# EAGLE schematic upperArm (EAGLE 9.6.2)
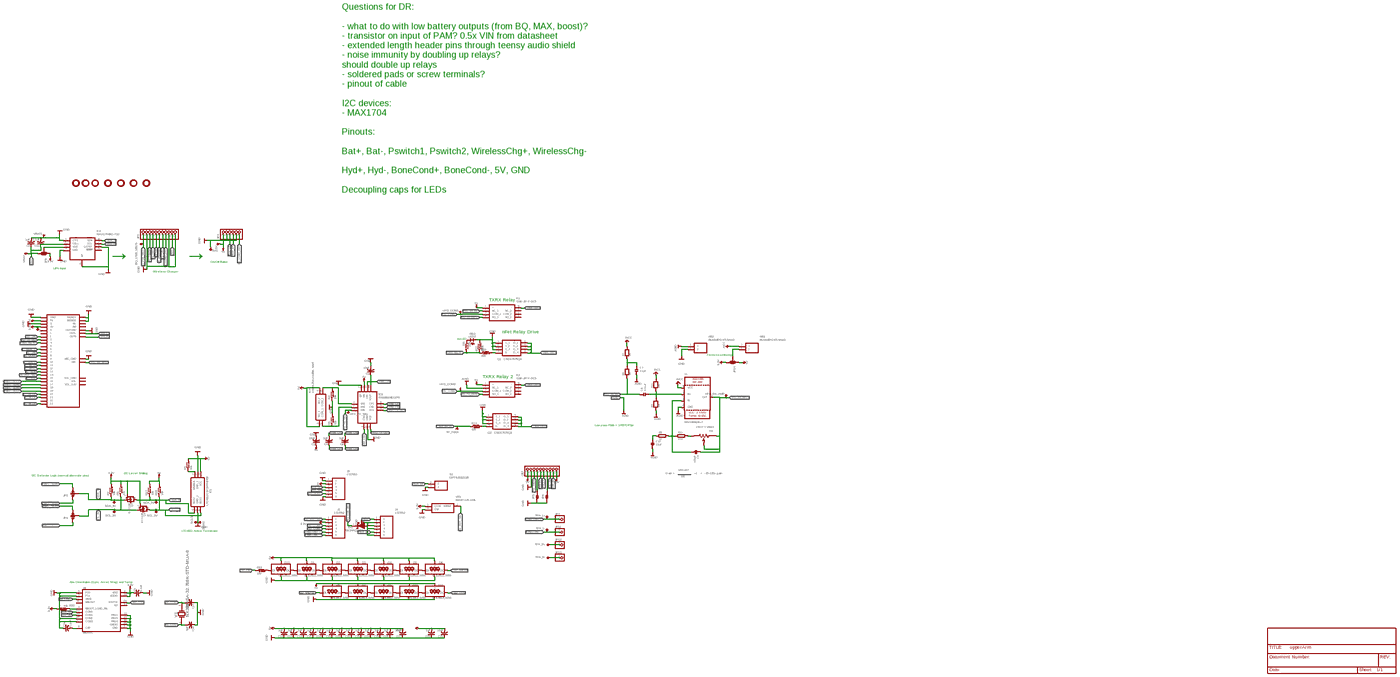
[diagram p0: schematic, sheet 1, overview]
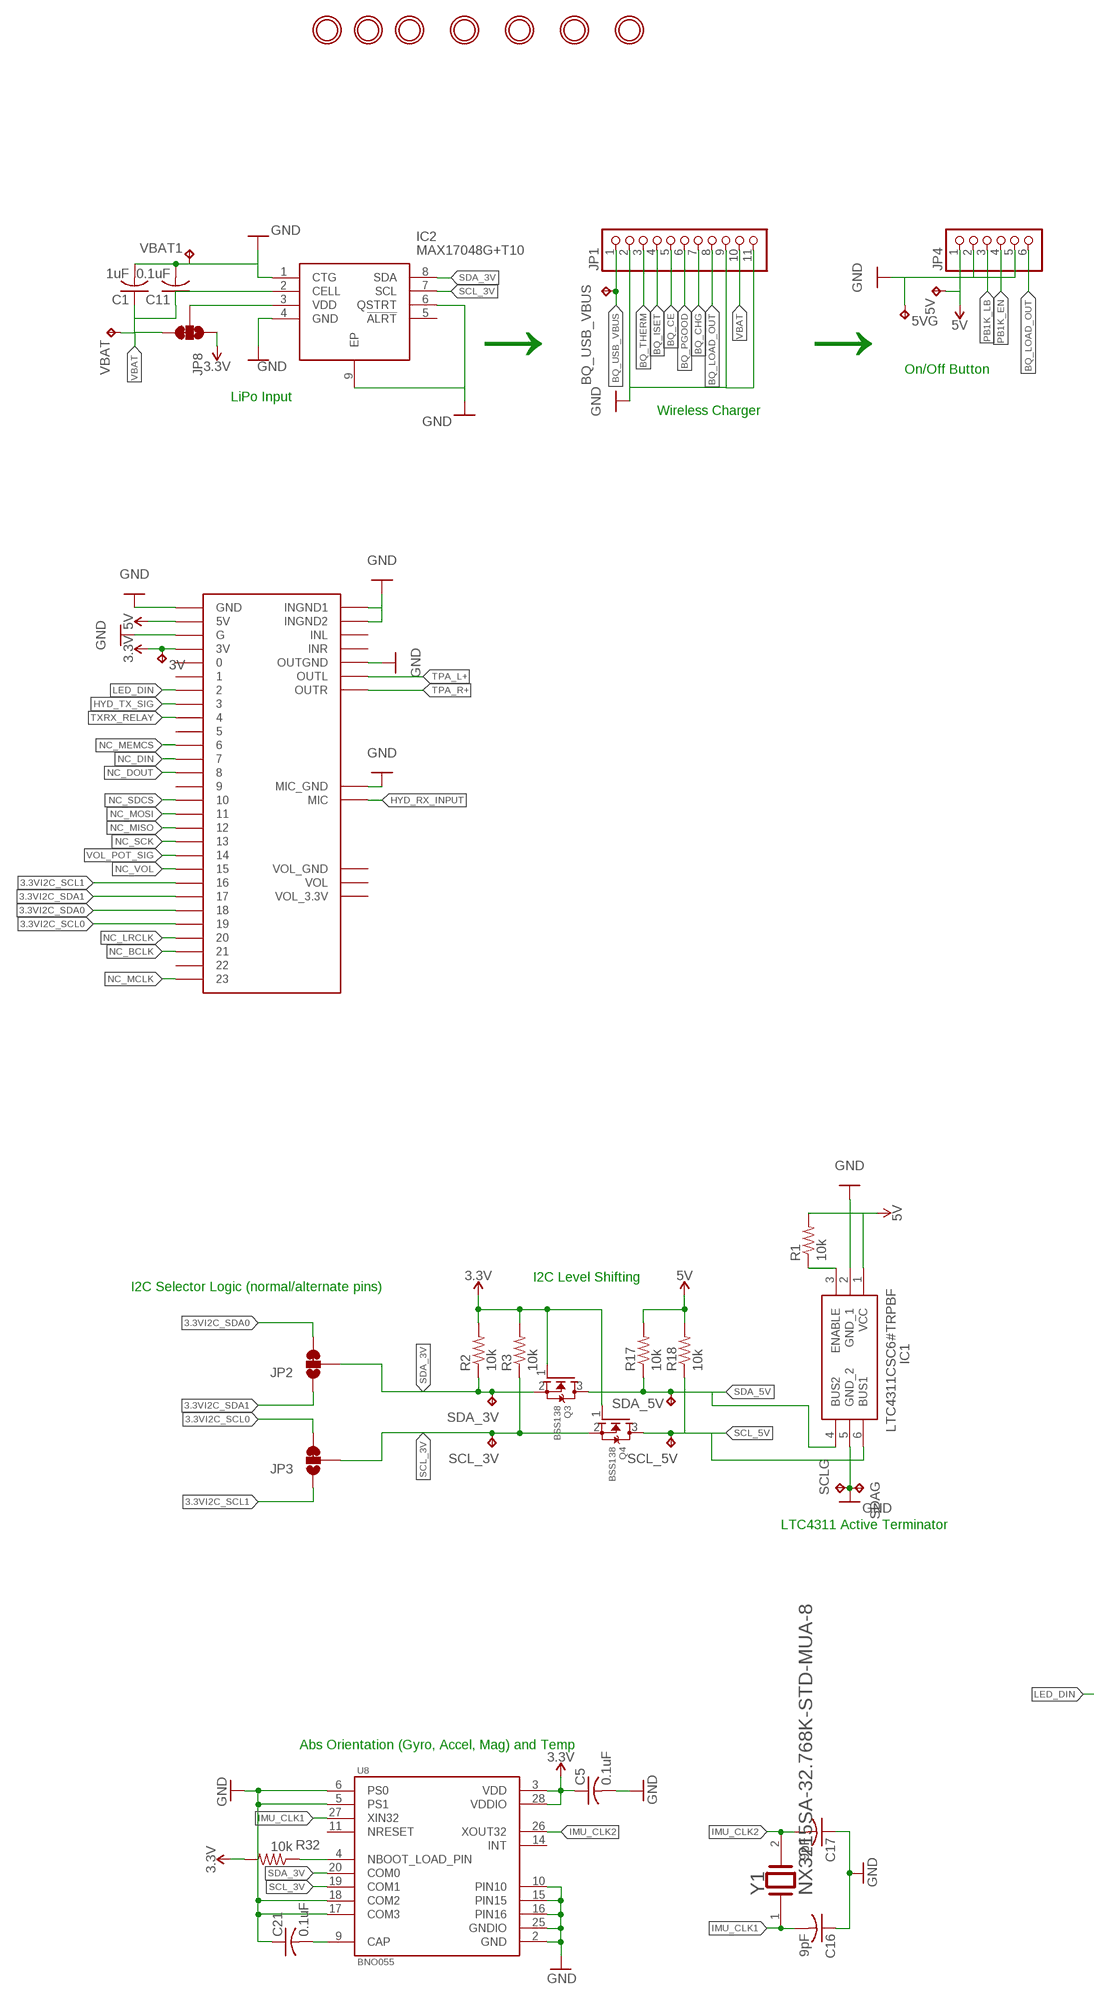
[diagram p1: schematic, sheet 1, part 1 of 4]
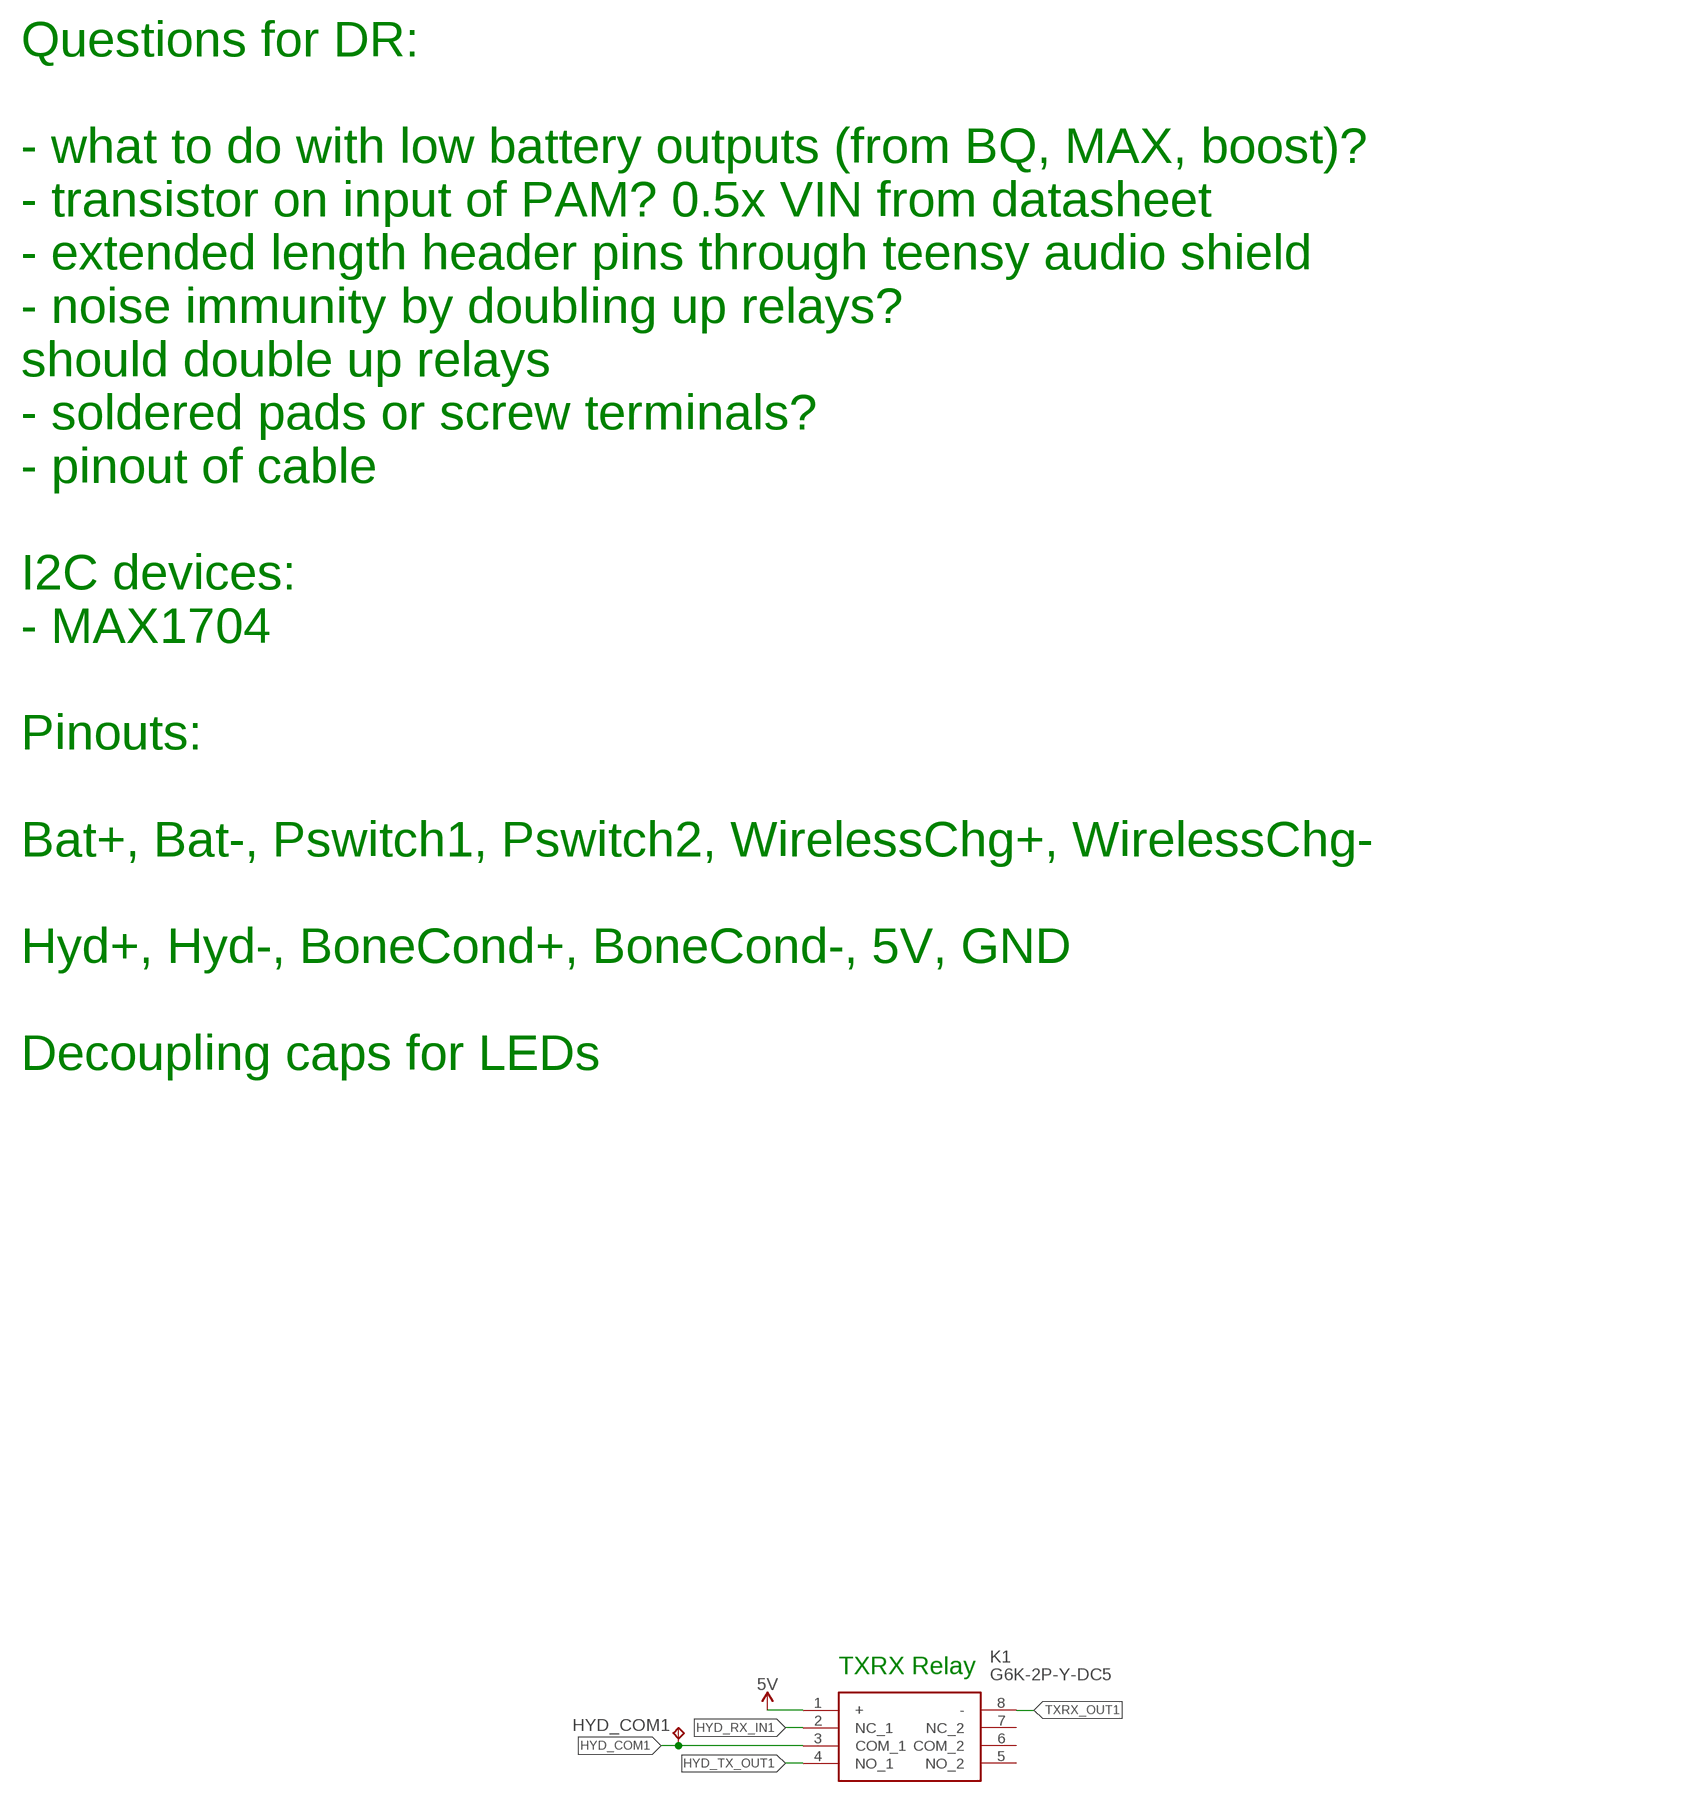
[diagram p2: schematic, sheet 1, part 2 of 4]
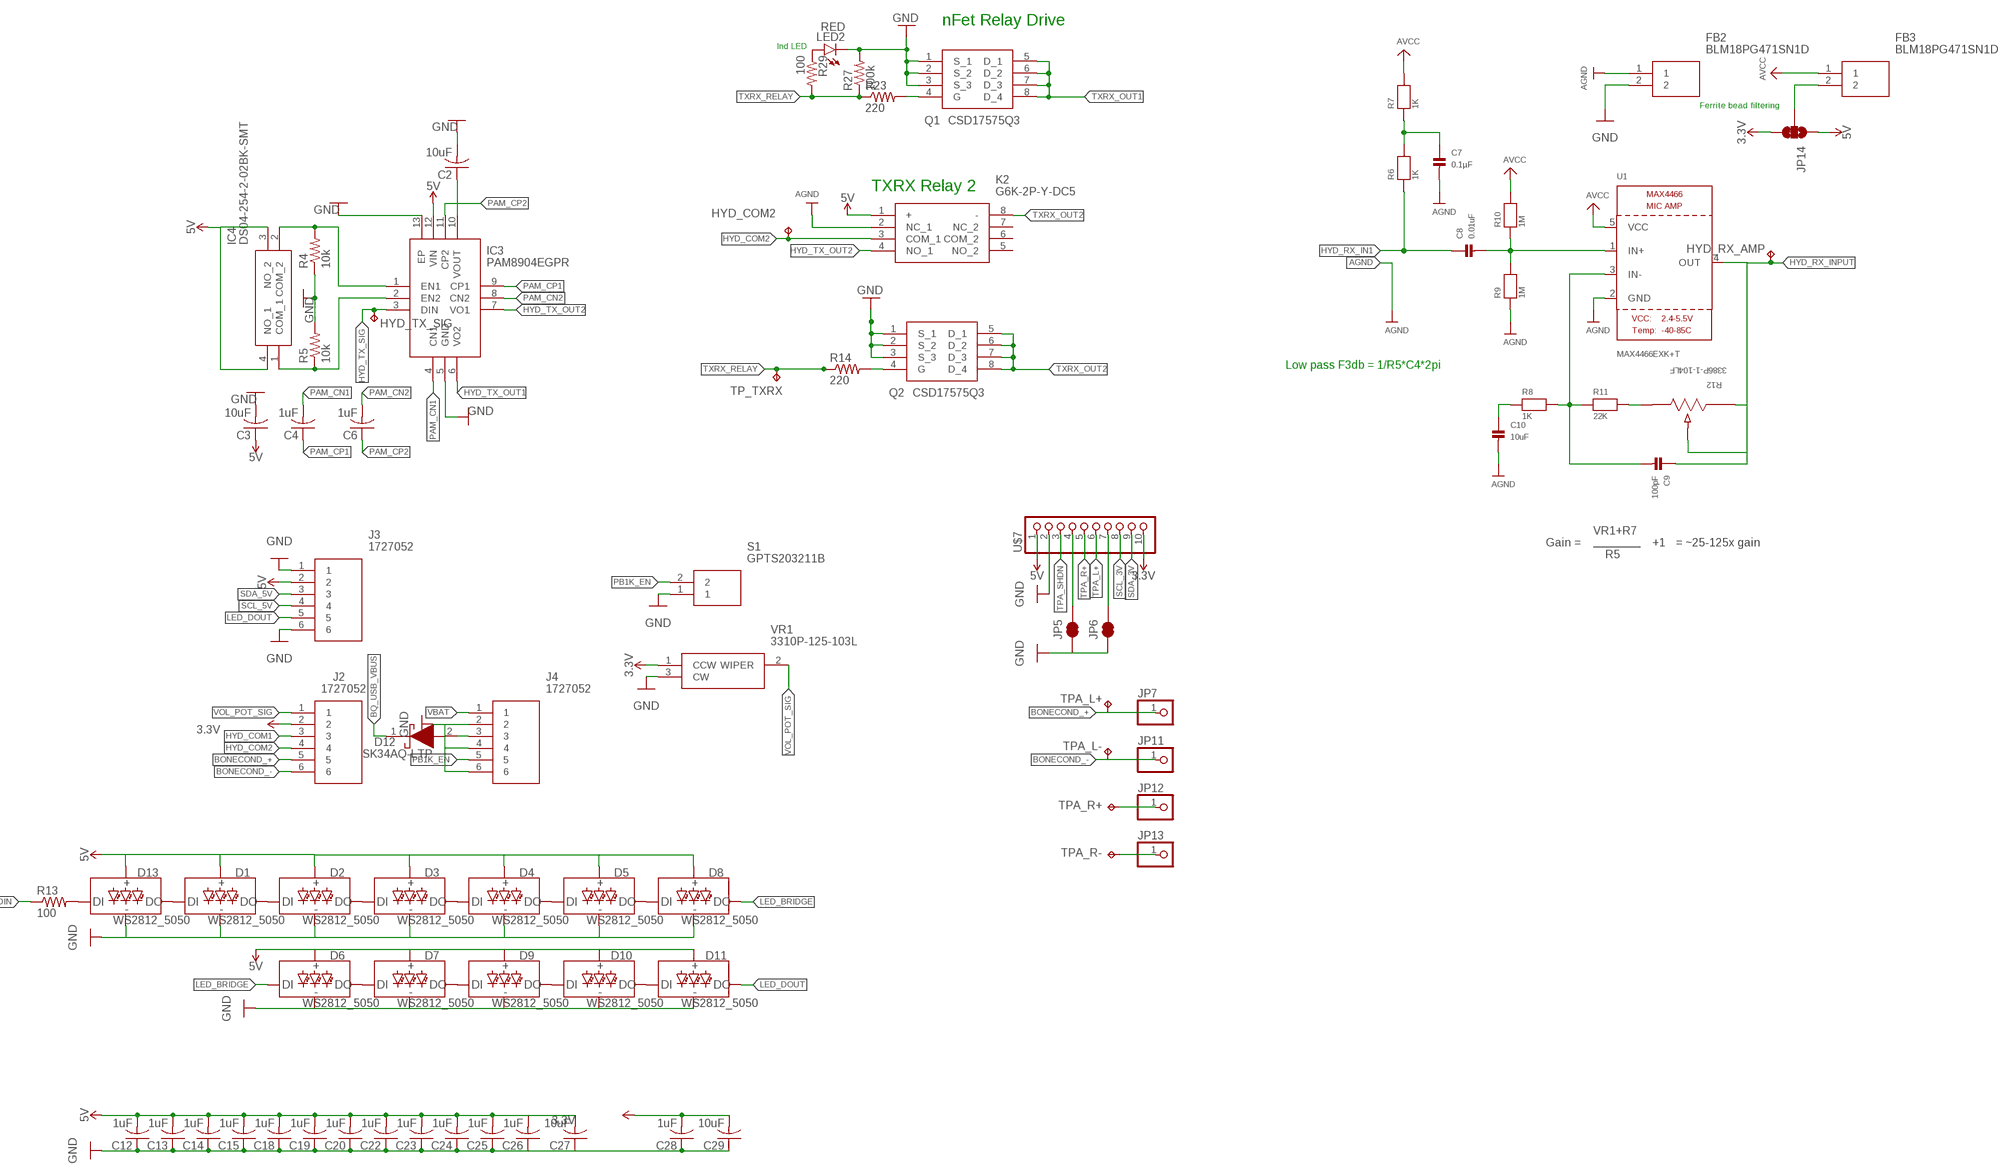
[diagram p3: schematic, sheet 1, part 3 of 4]
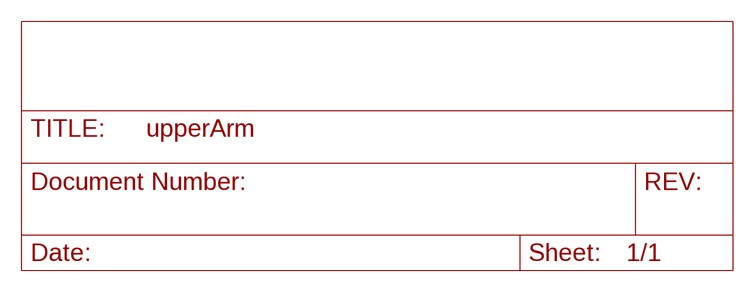
[diagram p4: schematic, sheet 1, part 4 of 4]

## Parts
3V  TPB1,27  [B1,27]
5V  TPB1,27  [B1,27]
5VG  TPB1,27  [B1,27]
BQ_USB_VBUS  TPB1,27  [B1,27]
C1  1uF  C-USC0805  [C0805]
C2  10uF  C-USC0805  [C0805]
C3  10uF  C-USC0805  [C0805]
C4  1uF  C-USC0805  [C0805]
C5  0.1uF  C-USC0805  [C0805]
C6  1uF  C-USC0805  [C0805]
C7  0.1µF  CAP_CERAMIC0805  [0805]
C8  0.01uF  CAP_CERAMIC0805  [0805]
C9  100pF  CAP_CERAMIC0805  [0805]
C10  10uF  CAP_CERAMIC0805  [0805]
C11  0.1uF  C-USC0805  [C0805]
C12  1uF  C-USC0805  [C0805]
C13  1uF  C-USC0805  [C0805]
C14  1uF  C-USC0805  [C0805]
C15  1uF  C-USC0805  [C0805]
C16  9pF  C-USC0805  [C0805]
C17  9pF  C-USC0805  [C0805]
C18  1uF  C-USC0805  [C0805]
C19  1uF  C-USC0805  [C0805]
C20  1uF  C-USC0805  [C0805]
C21  0.1uF  C-USC0805  [C0805]
C22  1uF  C-USC0805  [C0805]
C23  1uF  C-USC0805  [C0805]
C24  1uF  C-USC0805  [C0805]
C25  1uF  C-USC0805  [C0805]
C26  1uF  C-USC0805  [C0805]
C27  10uF  C-USC0805  [C0805]
C28  1uF  C-USC0805  [C0805]
C29  10uF  C-USC0805  [C0805]
D1  WS2812_5050  [WS2812-5X5-4PIN]
D2  WS2812_5050  [WS2812-5X5-4PIN]
D3  WS2812_5050  [WS2812-5X5-4PIN]
D4  WS2812_5050  [WS2812-5X5-4PIN]
D5  WS2812_5050  [WS2812-5X5-4PIN]
D6  WS2812_5050  [WS2812-5X5-4PIN]
D7  WS2812_5050  [WS2812-5X5-4PIN]
D8  WS2812_5050  [WS2812-5X5-4PIN]
D9  WS2812_5050  [WS2812-5X5-4PIN]
D10  WS2812_5050  [WS2812-5X5-4PIN]
D11  WS2812_5050  [WS2812-5X5-4PIN]
D12  SK34AQ-LTP  [DIOM5226X244N]
D13  WS2812_5050  [WS2812-5X5-4PIN]
FB2  BLM18PG471SN1D  [BLM18SP221SN1B]
FB3  BLM18PG471SN1D  [BLM18SP221SN1B]
HYD_COM1  TPB1,27  [B1,27]
HYD_COM2  TPB1,27  [B1,27]
HYD_RX_AMP  TPB1,27  [B1,27]
HYD_TX_SIG  TPB1,27  [B1,27]
IC1  LTC4311CSC6#TRPBF  [SOT65P210X100-6N]
IC2  MAX17048G+T10  [SON50P200X200X80-9N]
IC3  PAM8904EGPR  [QFN40P200X200X80-13N]
IC4  DS04-254-2-02BK-SMT  [DS04254202BKSMT]
J2  1727052  [1727052]
J3  1727052  [1727052]
J4  1727052  [1727052]
JP1  PINHD-1X11  [1X11]
JP2  JUMPER-SMT_3_1-NC_TRACE_NO-SILK  [SMT-JUMPER_3_1-NC_TRACE_NO-SILK]
JP3  JUMPER-SMT_3_1-NC_TRACE_NO-SILK  [SMT-JUMPER_3_1-NC_TRACE_NO-SILK]
JP4  PINHD-1X6  [1X06]
JP5  JUMPER-SMT_2_NC_TRACE_NO-SILK  [SMT-JUMPER_2_NC_TRACE_NO-SILK]
JP6  JUMPER-SMT_2_NC_TRACE_NO-SILK  [SMT-JUMPER_2_NC_TRACE_NO-SILK]
JP7  PINHD-1X1  [1X01]
JP8  JUMPER-SMT_3_1-NC_TRACE_NO-SILK  [SMT-JUMPER_3_1-NC_TRACE_NO-SILK]
JP11  PINHD-1X1  [1X01]
JP12  PINHD-1X1  [1X01]
JP13  PINHD-1X1  [1X01]
JP14  JUMPER-SMT_3_1-NC_TRACE_NO-SILK  [SMT-JUMPER_3_1-NC_TRACE_NO-SILK]
K1  G6K-2P-Y-DC5  [G6K2PYDC12]
K2  G6K-2P-Y-DC5  [G6K2PYDC12]
LED2  RED  LEDCHIP-LED0805  [CHIP-LED0805]
Q1  CSD17575Q3  [CSD16327]
Q2  CSD17575Q3  [CSD16327]
Q3  BSS138  MOSFET-NWIDE  [SOT23-WIDE]
Q4  BSS138  MOSFET-NWIDE  [SOT23-WIDE]
R1  10k  R-US_R0805  [R0805]
R2  10k  R-US_R0805  [R0805]
R3  10k  R-US_R0805  [R0805]
R4  10k  R-US_R0805  [R0805]
R5  10k  R-US_R0805  [R0805]
R6  1K  RESISTOR0805  [0805]
R7  1K  RESISTOR0805  [0805]
R8  1K  RESISTOR0805  [0805]
R9  1M  RESISTOR0805  [0805]
R10  1M  RESISTOR0805  [0805]
R11  22K  RESISTOR0805  [0805]
R12  3386P-1-104LF  [POT_3386P]
R13  100  R-US_R0603  [R0603]
R14  220  R-US_R0805  [R0805]
R17  10k  R-US_R0805  [R0805]
R18  10k  R-US_R0805  [R0805]
R23  220  R-US_R0805  [R0805]
R27  100k  R-US_R0805  [R0805]
R29  100  R-US_R0805  [R0805]
R32  10k  R-US_R0805  [R0805]
S1  GPTS203211B  [GPTS203211B]
SCL_3V  TPB1,27  [B1,27]
SCL_5V  TPB1,27  [B1,27]
SCLG  TPB1,27  [B1,27]
SDA_3V  TPB1,27  [B1,27]
SDA_5V  TPB1,27  [B1,27]
SDAG  TPB1,27  [B1,27]
TP_TXRX  TPB1,27  [B1,27]
TPA_L+  TPB1,27  [B1,27]
TPA_L-  TPB1,27  [B1,27]
TPA_R+  TPB1,27  [B1,27]
TPA_R-  TPB1,27  [B1,27]
U1  MAX4466EXK+T  MAX4466""  [SC70-5]
U8  BNO055  [LGA28R50P4X10_380X520X100]
U$1  AUDIOSHIELD  [AUDIOSHIELD]
U$7  PINHD-1X10  [1X10]
U$11  MOUNTINGHOLE2.5  [MOUNTINGHOLE_2.5_PLATED]
U$14  MOUNTINGHOLE2.5  [MOUNTINGHOLE_2.5_PLATED]
U$15  MOUNTINGHOLE2.5  [MOUNTINGHOLE_2.5_PLATED]
U$16  MOUNTINGHOLE2.5  [MOUNTINGHOLE_2.5_PLATED]
U$17  MOUNTINGHOLE2.5  [MOUNTINGHOLE_2.5_PLATED]
U$18  MOUNTINGHOLE2.5  [MOUNTINGHOLE_2.5_PLATED]
U$19  MOUNTINGHOLE2.5  [MOUNTINGHOLE_2.5_PLATED]
VBAT  TPB1,27  [B1,27]
VBAT1  TPB1,27  [B1,27]
VR1  3310P-125-103L  [3310P125103L]
Y1  NDK_NX3215SA-32.768K-STD-MUA-9  NDK_NX3215SA-32.768K-STD-MUA-8NDK_NX3215SA-32.768K-STD-MUA-8_0_0  [NDK_NX3215SA-32.768K-STD-MUA-8_0]

## Nets
3.3V [ICPower]: 3V.TP C5.1 C28.2 C29.2 J2.2 JP8.1 JP14.3 Q3.1(G) Q4.1(G) R2.2 R3.2 R32.2 U8.3(VDD) U8.28(VDDIO) U$1.3V U$7.10 VR1.1(CCW)
3.3VI2C_SCL0: JP3.3 U$1.19
3.3VI2C_SCL1: JP3.1 U$1.16
3.3VI2C_SDA0: JP2.3 U$1.18
3.3VI2C_SDA1: JP2.1 U$1.17
5V [ICPower]: 5V.TP C3.1 C12.2 C13.2 C14.2 C15.2 C18.2 C19.2 C20.2 C22.2 C23.2 C24.2 C25.2 C26.2 C27.2 D1.VCC D2.VCC D3.VCC D4.VCC D5.VCC D6.VCC D7.VCC D8.VCC D9.VCC D10.VCC D11.VCC D13.VCC IC1.1(VCC) IC3.12(VIN) IC4.3(NO_2) IC4.4(NO_1) J3.2 JP4.1 JP14.1 K1.1(+) K2.1(+) R1.2 R17.2 R18.2 U$1.5V U$7.1
AGND: C7.2 C10.2 FB2.1 K2.2(NC_1) R9.1 U1.2(GND)
AVCC: FB3.1 R7.2 R10.2 U1.5(VCC)
BONECOND_+: J2.5 JP7.1 TPA_L+.TP
BONECOND_-: J2.6 JP11.1 TPA_L-.TP
BQ_CE: JP1.5
BQ_CHG: JP1.7
BQ_ISET: JP1.4
BQ_LOAD_OUT: JP1.8 JP4.6
BQ_PGOOD: JP1.6
BQ_THERM: JP1.3
BQ_USB_VBUS: BQ_USB_VBUS.TP D12.1(K) JP1.1
GND [ICPower]: 5VG.TP C1.2 C2.2 C3.2 C5.2 C11.2 C12.1 C13.1 C14.1 C15.1 C16.1 C17.1 C18.1 C19.1 C20.1 C21.1 C22.1 C23.1 C24.1 C25.1 C26.1 C27.1 C28.1 C29.1 D1.GND D2.GND D3.GND D4.GND D5.GND D6.GND D7.GND D8.GND D9.GND D10.GND D11.GND D13.GND FB2.2 IC1.2(GND_1) IC1.5(GND_2) IC2.1(CTG) IC2.4(GND) IC2.6(QSTRT) IC2.9(EP) IC3.5(GND) IC3.13(EP) J3.1 J3.6 J4.2 J4.4 J4.6 JP1.2 JP1.9 JP1.11 JP4.2 JP4.5 JP5.1 JP6.1 LED2.C Q1.1(S_1) Q1.2(S_2) Q1.3(S_3) Q2.1(S_1) Q2.2(S_2) Q2.3(S_3) R4.1 R5.2 R27.2 S1.1 SCLG.TP SDAG.TP U8.2(GND) U8.5(PS1) U8.6(PS0) U8.10(PIN10) U8.15(PIN15) U8.16(PIN16) U8.17(COM3) U8.18(COM2) U8.25(GNDIO) U$1.G U$1.GND U$1.GND_MIC(MIC_GND) U$1.INGND1 U$1.INGND2 U$1.OUTGND U$7.2 VBAT1.TP VR1.3(CW)
HYD_COM1: HYD_COM1.TP J2.3 K1.3(COM_1)
HYD_COM2: HYD_COM2.TP J2.4 K2.3(COM_1)
HYD_RX_IN1: C8.1 K1.2(NC_1) R6.1
HYD_RX_INPUT: C9.1 HYD_RX_AMP.TP R12.1 R12.2 U1.4(OUT) U$1.MIC
HYD_TX_OUT1: IC3.6(VO2) K1.4(NO_1)
HYD_TX_OUT2: IC3.7(VO1) K2.4(NO_1)
HYD_TX_SIG: HYD_TX_SIG.TP IC3.3(DIN) U$1.3
IMU_CLK1: C16.2 U8.27(XIN32) Y1.1
IMU_CLK2: C17.2 U8.26(XOUT32) Y1.2
LED_BRIDGE: D6.DI D8.DO
LED_DIN: R13.1 U$1.2
LED_DOUT: D11.DO J3.5
N$1: IC1.3(ENABLE) R1.1
N$2: JP12.1 TPA_R+.TP
N$3: JP13.1 TPA_R-.TP
N$4: D6.DO D7.DI
N$5: IC2.3(VDD) JP8.2
N$6: Q2.4(G) R14.2
N$7: C2.1 IC3.10(VOUT)
N$8: D13.DI R13.2
N$9: JP5.2 U$7.4
N$10: D1.DO D2.DI
N$12: IC3.1(EN1) IC4.2(COM_2) R4.2
N$13: IC3.2(EN2) IC4.1(COM_1) R5.1
N$15: FB3.2 JP14.2
N$16: C7.1 R6.2 R7.1
N$17: C8.2 R9.2 R10.1 U1.1(IN+)
N$18: D1.DI D13.DO
N$19: C9.2 R8.2 R11.1 U1.3(IN-)
N$20: C10.1 R8.1
N$21: R11.2 R12.3
N$24: D12.2(A) J4.3
N$25: D2.DO D3.DI
N$26: D3.DO D4.DI
N$27: D4.DO D5.DI
N$28: D5.DO D8.DI
N$29: D7.DO D9.DI
N$30: D9.DO D10.DI
N$31: D10.DO D11.DI
N$32: JP6.2 U$7.7
N$37: C21.2 U8.9(CAP)
N$40: R32.1 U8.4(NBOOT_LOAD_PIN)
N$81: Q1.4(G) R23.2
N$82: LED2.A R29.1
NC_BCLK: U$1.21
NC_DIN: U$1.7
NC_DOUT: U$1.8
NC_LRCLK: U$1.20
NC_MCLK: U$1.23
NC_MEMCS: U$1.6
NC_MISO: U$1.12
NC_MOSI: U$1.11
NC_SCK: U$1.13
NC_SDCS: U$1.10
NC_VOL: U$1.15
PAM_CN1: C4.2 IC3.4(CN1)
PAM_CN2: C6.2 IC3.8(CN2)
PAM_CP1: C4.1 IC3.9(CP1)
PAM_CP2: C6.1 IC3.11(CP2)
PB1K_EN: J4.5 JP4.4 S1.2
PB1K_LB: JP4.3
SCL_3V: IC2.7(SCL) JP3.2 Q4.2(S) R3.1 SCL_3V.TP U8.19(COM1) U$7.8
SCL_5V: IC1.6(BUS1) J3.4 Q4.3(D) R18.1 SCL_5V.TP
SDA_3V: IC2.8(SDA) JP2.2 Q3.2(S) R2.1 SDA_3V.TP U8.20(COM0) U$7.9
SDA_5V: IC1.4(BUS2) J3.3 Q3.3(D) R17.1 SDA_5V.TP
TPA_L+: U$1.OUTL U$7.6
TPA_R+: U$1.OUTR U$7.5
TPA_SHDN: U$7.3
TXRX_OUT1: K1.8(-) Q1.5(D_1) Q1.6(D_2) Q1.7(D_3) Q1.8(D_4)
TXRX_OUT2: K2.8(-) Q2.5(D_1) Q2.6(D_2) Q2.7(D_3) Q2.8(D_4)
TXRX_RELAY: R14.1 R23.1 R27.1 R29.2 TP_TXRX.TP U$1.4
VBAT: C1.1 C11.1 IC2.2(CELL) J4.1 JP1.10 JP8.3 VBAT.TP
VOL_POT_SIG: J2.1 U$1.14 VR1.2(WIPER)
Unconnected: IC2.5(!ALRT) K1.5(NO_2) K1.6(COM_2) K1.7(NC_2) K2.5(NO_2) K2.6(COM_2) K2.7(NC_2) U8.11(NRESET) U8.14(INT) U$1.0 U$1.1 U$1.5 U$1.9 U$1.22 U$1.INL U$1.INR U$1.VOL U$1.VOL_3.3V U$1.VOL_GND

## Notes on the sheet
- Questions for DR:
  
  - what to do with low battery outputs (from BQ, MAX, boost)?
  - transistor on input of PAM? 0.5x VIN from datasheet 
  - extended length header pins through teensy audio shield
  - noise immunity by doubling up relays?
  should double up relays
  - soldered pads or screw terminals?
  - pinout of cable
  
  I2C devices:
  - MAX1704
  
  Pinouts:
  
  Bat+, Bat-, Pswitch1, Pswitch2, WirelessChg+, WirelessChg-
  
  Hyd+, Hyd-, BoneCond+, BoneCond-, 5V, GND
  
  Decoupling caps for LEDs
- → | →
- On/Off Button
- LiPo Input
- Wireless Charger
- TXRX Relay
- nFet Relay Drive
- Ind LED
- Ferrite bead filtering
- TXRX Relay 2
- Low pass F3db = 1/R5*C4*2pi
- VR1+R7
- I2C Selector Logic (normal/alternate pins) | I2C Level Shifting | Gain = | +1 | = ~25-125x gain
- R5
- LTC4311 Active Terminator
- Abs Orientation (Gyro, Accel, Mag) and Temp

## Library data of the parts
3V 5V 5VG BQ_USB_VBUS HYD_COM1 HYD_COM2 HYD_RX_AMP HYD_TX_SIG SCL_3V SCL_5V SCLG SDA_3V SDA_5V SDAG TP_TXRX TPA_L+ TPA_L- TPA_R+ TPA_R- VBAT VBAT1 = testpad:TP: Test pad
C1-C6 C11-C29 = rcl:C-US: CAPACITOR, American symbol; SPICEPREFIX: C
C7-C10 = microbuilder:CAP_CERAMIC: Ceramic Capacitors 0402 - 0402 Surface Mount Capacitors 16pF 50V 5% [Digikey: 445-4899-2-ND] 18pF 50V 5% [Digikey: 490-1281-2-ND] 22pF 50V 5% [Digikey: 490-1283-2-ND] 68pF 50V 5% [Digikey: 490-1289-2-ND] 0.1uF 10V 10% [Digikey: 490-1318-2-ND] 1.0uF 6.3V 10% [Digikey: 490-1320-2-ND] 0603 - 0603 Surface Mount Capacitors 16 pF 50V 5% [Digikey: 445-5051-2-ND] 22 pF 50V [Digikey: PCC220ACVTR-ND] 33 pF 50V 5% [Digikey: 490-1415-1-ND] 56pF 50V 5% [Digikey: 490-1421-1-ND] 220pF 50V 5% [Digikey: 445-1285-1-ND] 680 pF 50V 2200 pF 50V 5% C0G [Digikey: 445-1297-1-ND] 5600 pF 100V 5% X7R [Digikey: 478-3711-1-ND] 0.1 µF 25V 10% [Digikey: PCC2277TR-ND] 0.22 µF 16V 10% X7R [Digikey: 445-1318-1-ND] 1.0 µF 25V 10% [Digikey: 445-5146-2-ND] 0603 - RF Specific 3pF 250V +/-0.1pF RF [Digikey: 712-1347-1-ND] 18 pF 250V 5% [Digikey: 478-3505-1-ND or 712-1322-1-ND] 56 pF 250V 5% C0G RF [Digikey: 490-4867-1-ND] 68 pF 250V RF [Digikey: 490-4868-1-ND] 0805 - 0805 Surface Mount Capacitors 220 pF 250V 2% RF Ceramic Capacitor [Digikey: 712-1398-1-ND] 1000 pF 50V 2% NP0 Ceramic Capacitor [Digikey: 478-3760-1-ND] 0.1 µF 25V 10% Ceramic Capacitor [Digikey: PCC1828TR-ND] 1.0 µF 16V 10% Ceramic Capacitor[Digikey: 490-1691-2-ND] 10.0 µF 10V 10% Ceramic Capacitor[Digikey: 709-1228-1-ND] 10.0 uF 16V 10% Ceramic Capacitor [Digikey: 478-5165-2-ND] 47 uF 6.3V 20% Ceramic Capacitor [Digikey: 587-1779-1-ND or 399-5506-1-ND] 1206 - 1206 Surface Mount Capacitors 47uF 10V 20% Ceramic Capacitor [Digikey: 490-5528-1-ND or 399-5508-1-ND or 445-6010-1-ND] 100uF 6.3V -20%, +80% Y5V Ceramic Capacitor (Digikey: 490-4512-1-ND, Mouser: 81-GRM31CF50J107ZE1L)
D1-D11 D13 = SparkFun-LED:WS2812: Addressable RGB LED - 1 Wire Common names: WS2812, SK6812, Neopixel, APA-106, etc. SMD LED with built-in controller IC. Color: Red/Green/Blue SparkFun Products: LED-SMD RGB (WS2812) <https://www.sparkfun.com/products/11821> LED - RGB Addressable, PTH, 5mm Diffused (5 Pack) <https://www.sparkfun.com/products/12986> LED - RGB Addressable, PTH, 5mm Clear (5 Pack) <https://www.sparkfun.com/products/12999> Blynk Board - ESP8266 <https://www.sparkfun.com/products/13794> Datasheet referenced for footprint: WS2812B-PTH <https://cdn.sparkfun.com/datasheets/Components/LED/COM-12877.pdf>; PROD_ID: DIO-12503
D12 = SamacSys_Parts:SK34AQ-LTP: SCHOTTKY BARRIER RECTIFIERS 40V 3A,SMA Source: Datasheet <https://mccsemi.com/pdf/Products/SK34AQ-L_SK36AQ-L(SMA).pdf>; ARROW_PART_NUMBER: SK34AQ-LTP; ARROW_PRICE-STOCK: https://www.arrow.com/en/products/sk34aq-ltp/micro-commercial-components?region=nac; DESCRIPTION: SCHOTTKY BARRIER RECTIFIERS 40V 3A,SMA; HEIGHT: 2.44mm; MANUFACTURER_NAME: MCC; MANUFACTURER_PART_NUMBER: SK34AQ-LTP; MOUSER_PART_NUMBER: 833-SK34AQ-LTP; MOUSER_PRICE-STOCK: https://www.mouser.co.uk/ProductDetail/Micro-Commercial-Components-MCC/SK34AQ-LTP?qs=ulEaXIWI0c8bpRN15seU2Q%3D%3D
FB2 FB3 = SamacSys_Parts:BLM18PG471SN1D: 0603 Ferrite Bead,470R,25%,1A,R2 Source: Datasheet <http://www.murata.com/~/media/webrenewal/support/library/catalog/products/emc/emifil/c31e.ashx?la=en-gb>; ARROW_PART_NUMBER: BLM18PG471SN1D; ARROW_PRICE-STOCK: https://www.arrow.com/en/products/blm18pg471sn1d/murata-manufacturing?region=nac; DESCRIPTION: 0603 Ferrite Bead,470R,25%,1A,R2; HEIGHT: 0.95mm; MANUFACTURER_NAME: Murata Electronics; MANUFACTURER_PART_NUMBER: BLM18PG471SN1D; MOUSER_PART_NUMBER: 81-BLM18PG471SN1D; MOUSER_PRICE-STOCK: https://www.mouser.co.uk/ProductDetail/Murata-Electronics/BLM18PG471SN1D?qs=EYzdjubb4S%2FN1Ip39GrHyg%3D%3D
IC1 = SamacSys_Parts:LTC4311CSC6#TRPBF: Interface - Specialized I2C/SMBus Rise Time Accelerator Source: Datasheet <https://www.analog.com/media/en/technical-documentation/data-sheets/4311fa.pdf>; ARROW_PART_NUMBER: LTC4311CSC6#TRPBF; ARROW_PRICE-STOCK: https://www.arrow.com/en/products/ltc4311csc6trpbf/analog-devices?region=nac; DESCRIPTION: Interface - Specialized I2C/SMBus Rise Time Accelerator; HEIGHT: 1mm; MANUFACTURER_NAME: Analog Devices; MANUFACTURER_PART_NUMBER: LTC4311CSC6#TRPBF; MOUSER_PART_NUMBER: 584-LTC4311CSC6TRPBF; MOUSER_PRICE-STOCK: https://www.mouser.co.uk/ProductDetail/Analog-Devices/LTC4311CSC6TRPBF?qs=hVkxg5c3xu8dDGkXCTUXoQ%3D%3D
IC2 = SamacSys_Parts:MAX17048G+T10: 3A 1-Cell/2-Cell Fuel Gauge with ModelGauge Source: Datasheet <https://www.analog.com/MAX17048/datasheet>; ARROW_PART_NUMBER: MAX17048G+T10; ARROW_PRICE-STOCK: https://www.arrow.com/en/products/max17048gt10/analog-devices?region=nac; DESCRIPTION: 3A 1-Cell/2-Cell Fuel Gauge with ModelGauge; HEIGHT: 0.8mm; MANUFACTURER_NAME: Analog Devices; MANUFACTURER_PART_NUMBER: MAX17048G+T10; MOUSER_PART_NUMBER: 700-MAX17048G+T10; MOUSER_PRICE-STOCK: https://www.mouser.co.uk/ProductDetail/Analog-Devices-Maxim-Integrated/MAX17048G%2bT10?qs=D7PJwyCwLAoGnnn8jEPRBQ%3D%3D
IC3 = SamacSys_Parts:PAM8904EGPR: Audio Amplifiers Audio High Volt Source: Datasheet <https://www.diodes.com//assets/Datasheets/PAM8904E.pdf>; ARROW_PART_NUMBER: PAM8904EGPR; ARROW_PRICE-STOCK: https://www.arrow.com/en/products/pam8904egpr/diodes-incorporated; DESCRIPTION: Audio Amplifiers Audio High Volt; HEIGHT: 0.8mm; MANUFACTURER_NAME: Diodes Incorporated; MANUFACTURER_PART_NUMBER: PAM8904EGPR; MOUSER_PART_NUMBER: 621-PAM8904EGPR; MOUSER_PRICE-STOCK: https://www.mouser.co.uk/ProductDetail/Diodes-Incorporated/PAM8904EGPR?qs=EBDBlbfErPxEsxcCuoWH6w%3D%3D
IC4 = SamacSys_Parts:DS04-254-2-02BK-SMT: DIP Switches / SIP Switches DIP Switch, SPST, 2.54 pitch, flat actuator, SMT, 2 position, Black Source: Datasheet <https://pt.mouser.com/datasheet/2/670/ds04_254_smt-1777718.pdf>; ARROW_PART_NUMBER: DS04-254-2-02BK-SMT; ARROW_PRICE-STOCK: https://www.arrow.com/en/products/ds04-254-2-02bk-smt/cui-devices?region=nac; DESCRIPTION: DIP Switches / SIP Switches DIP Switch, SPST, 2.54 pitch, flat actuator, SMT, 2 position, Black; HEIGHT: 4.85mm; MANUFACTURER_NAME: Same Sky; MANUFACTURER_PART_NUMBER: DS04-254-2-02BK-SMT; MOUSER_PART_NUMBER: 490-DS04254202BK-SMT; MOUSER_PRICE-STOCK: https://www.mouser.co.uk/ProductDetail/Same-Sky/DS04-254-2-02BK-SMT?qs=wnTfsH77Xs4sTcTiPxa5bg%3D%3D
J2-J4 = SamacSys_Parts:1727052: PCB terminal block, nominal current: 13.5 A, rated voltage (III/2): 200 V, nominal cross section: 1.5 mm?, Number of potentials: 6, Number of rows: 1, Number of positions per row: 6, product range: MKDS 1, pitch: 3.81 mm, connection method: Screw connection with tension sleeve, mounting: Wave soldering, conductor/PCB connection direction: 0 ?, color: green, Pin layout: Linear pinning, Solder pin [P]: 3.5 mm, type of packaging: packed in cardboard Source: Datasheet <http://www.phoenixcontact.com/de/produkte/1727052/pdf>; ARROW_PART_NUMBER: 1727052; ARROW_PRICE-STOCK: https://www.arrow.com/en/products/1727052/phoenix-contact?region=nac; DESCRIPTION: PCB terminal block, nominal current: 13.5 A, rated voltage (III/2): 200 V, nominal cross section: 1.5 mm?, Number of potentials: 6, Number of rows: 1, Number of positions per row: 6, product range: MKDS 1, pitch: 3.81 mm, connection method: Screw connection with tension sleeve, mounting: Wave soldering, conductor/PCB connection direction: 0 ?, color: green, Pin layout: Linear pinning, Solder pin [P]: 3.5 mm, type of packaging: packed in cardboard; HEIGHT: 8.65mm; MANUFACTURER_NAME: Phoenix Contact; MANUFACTURER_PART_NUMBER: 1727052; MOUSER_PART_NUMBER: 651-1727052; MOUSER_PRICE-STOCK: https://www.mouser.co.uk/ProductDetail/Phoenix-Contact/1727052?qs=WWq3Ki8dym7VpMyTMk0i8A%3D%3D
JP1 = pinhead:PINHD-1X11: PIN HEADER
JP2 JP3 JP8 JP14 = SparkFun-Jumpers:JUMPER-SMT_3_1-NC_TRACE: Normally closed trace jumper (1 of 2 connections) This jumper has a trace between two pads so it's normally closed (NC). The other connection is normally open (NO). Use a razor knife to open the connection. For best results follow the IPC guidelines for cutting traces: Cutout at least 0.063 mm (0.005 in). Remove all loose material to clean up the cut area. Seal the cut with an approved epoxy. Reapply solder to reclose the connection, or to close the NO connection.
JP4 = pinhead:PINHD-1X6: PIN HEADER
JP5 JP6 = SparkFun-Jumpers:JUMPER-SMT_2_NC_TRACE: Normally closed trace jumper This jumper has a trace between two pads so it's normally closed (NC). Use a razor knife to open the connection. For best results follow the IPC guidelines for cutting traces: Cutout at least 0.063 mm (0.005 in). Remove all loose material to clean up the cut area. Seal the cut with an approved epoxy. Reapply solder to reclose the connection.
JP7 JP11-JP13 = pinhead:PINHD-1X1: PIN HEADER
K1 K2 = SamacSys_Parts:G6K-2P-Y-DC5: Low Signal Relays - PCB ThruHole NoLatch 3.2 DPDT 5VDC 100mW Source: Datasheet <https://omronfs.omron.com/en_US/ecb/products/pdf/en-g6k.pdf>; DESCRIPTION: Low Signal Relays - PCB ThruHole NoLatch 3.2 DPDT 5VDC 100mW; HEIGHT: 5.3mm; MANUFACTURER_NAME: Omron Electronics; MANUFACTURER_PART_NUMBER: G6K-2P-Y-DC5; MOUSER_PART_NUMBER: 653-G6K-2P-Y-DC5; MOUSER_PRICE-STOCK: https://www.mouser.co.uk/ProductDetail/Omron-Electronics/G6K-2P-Y-DC5?qs=HDDQUw%2F3PhrvM4dCY49XOA%3D%3D
LED2 = led:LED: LED OSRAM: - CHIPLED LG R971, LG N971, LY N971, LG Q971, LY Q971, LO R971, LY R971 LH N974, LH R974 LS Q976, LO Q976, LY Q976 LO Q996 - Hyper CHIPLED LW Q18S LB Q993, LB Q99A, LB R99A - SideLED LS A670, LO A670, LY A670, LG A670, LP A670 LB A673, LV A673, LT A673, LW A673 LH A674 LY A675 LS A676, LA A676, LO A676, LY A676, LW A676 LS A679, LY A679, LG A679 - Hyper Micro SIDELED® LS Y876, LA Y876, LO Y876, LY Y876 LT Y87S - SmartLED LW L88C, LW L88S LB L89C, LB L89S, LG L890 LS L89K, LO L89K, LY L89K LS L896, LA L896, LO L896, LY L896 - TOPLED LS T670, LO T670, LY T670, LG T670, LP T670 LSG T670, LSP T670, LSY T670, LOP T670, LYG T670 LG T671, LOG T671, LSG T671 LB T673, LV T673, LT T673, LW T673 LH T674 LS T676, LA T676, LO T676, LY T676, LB T676, LH T676, LSB T676, LW T676 LB T67C, LV T67C, LT T67C, LS T67K, LO T67K, LY T67K, LW E67C LS E67B, LA E67B, LO E67B, LY E67B, LB E67C, LV E67C, LT E67C LW T67C LS T679, LY T679, LG T679 LS T770, LO T770, LY T770, LG T770, LP T770 LB T773, LV T773, LT T773, LW T773 LH T774 LS E675, LA E675, LY E675, LS T675 LS T776, LA T776, LO T776, LY T776, LB T776 LHGB T686 LT T68C, LB T68C - Hyper Mini TOPLED® LB M676 - Mini TOPLED Santana® LG M470 LS M47K, LO M47K, LY M47K Source: http://www.osram.convergy.de LUXEON: - LUMILED® LXK2-PW12-R00, LXK2-PW12-S00, LXK2-PW14-U00, LXK2-PW14-V00 LXK2-PM12-R00, LXK2-PM12-S00, LXK2-PM14-U00 LXK2-PE12-Q00, LXK2-PE12-R00, LXK2-PE12-S00, LXK2-PE14-T00, LXK2-PE14-U00 LXK2-PB12-K00, LXK2-PB12-L00, LXK2-PB12-M00, LXK2-PB14-N00, LXK2-PB14-P00, LXK2-PB14-Q00 LXK2-PR12-L00, LXK2-PR12-M00, LXK2-PR14-Q00, LXK2-PR14-R00 LXK2-PD12-Q00, LXK2-PD12-R00, LXK2-PD12-S00 LXK2-PH12-R00, LXK2-PH12-S00 LXK2-PL12-P00, LXK2-PL12-Q00, LXK2-PL12-R00 Source: www.luxeon.com KINGBRIGHT: KA-3528ASYC Source: www.kingbright.com
Q1 Q2 = SamacSys_Parts:CSD17575Q3: 30V, N ch NexFET MOSFET, single SON3x3, 3.2mOhm Source: Datasheet <http://www.ti.com/lit/gpn/csd17575q3>; ARROW_PART_NUMBER: CSD17575Q3; ARROW_PRICE-STOCK: https://www.arrow.com/en/products/csd17575q3/texas-instruments; DESCRIPTION: 30V, N ch NexFET MOSFET, single SON3x3, 3.2mOhm; HEIGHT: mm; MANUFACTURER_NAME: Texas Instruments; MANUFACTURER_PART_NUMBER: CSD17575Q3; MOUSER_PART_NUMBER: 595-CSD17575Q3; MOUSER_PRICE-STOCK: https://www.mouser.co.uk/ProductDetail/Texas-Instruments/CSD17575Q3?qs=1MXlzafEN3%2FTIl0%2FpyGUYQ%3D%3D
Q3 Q4 = microbuilder:MOSFET-N: N-Channel Mosfet LEGEND VDS: Voltage Drain-Source ID: Drain Current RDS(ON): Drain-Source On-State Resistance VGS(TH): Gate-Source Threshold Voltage CISS: Drain-Source Input Capacitance SOT-23 Name VDS ID RDS(ON) VGS(TH) CISS Order Number 2N7002E 60V 260mA 2.5 Ohm 2.5V @ 250uA 26.7pF @ 25V 2N7002ET1GOSTR-ND BSH103 30V 850mA 400 mOhm 400mV @ 1mA 83pF @ 24V BSH103,235-ND BSS138 60V 320mA 1.6 Ohm 1.5V @ 250uA 50pF @ 10V Mouser: 771-BSS138PW115 DMN2075U-7 20V 4.2A 38 mOhm 1V @ 250 uA 594.3pF @ 10V DMN2075U-7DICT-ND * BSS138 good choice for I2C level-shifting
R1-R5 R13 R14 R17 R18 R23 R27 R29 R32 = rcl:R-US_: RESISTOR, American symbol; SPICEPREFIX: R
R6-R11 = microbuilder:RESISTOR: Resistors 0402 - 0402 Surface Mount Package 22 Ohm 1% 1/16W [Digikey: 311-22.0LRTR-ND] 33 Ohm 5% 1/16W 1.0K 5% 1/16W 1.5K 5% 1/16W 2.0K 1% 1/16W 10.0K 1% 1/16W [Digikey: 311-10.0KLRTR-ND] 10.0K 5% 1/16W [Digikey: RMCF0402JT10K0TR-ND] 12.1K 1% 1/16W [Digikey: 311-22.0LRTR-ND] 100.0K 5% 1/16W 0603 - 0603 Surface Mount Package 0 Ohm 1/10 Watt 1% Resistor 15 Ohm 1/10 Watt 1% Resistor 33 Ohm 1/10 Watt 1% Resistor 49.9 Ohm 1/10 Watt 1% Resistor 100 Ohm 1/10 Watt 1% Resistor 150 Ohm 1/10 Watt 1% Resistor 240 Ohm 1/10 Watt 1% Resistor 390 Ohm 1/10 Watt 1% Resistor 560 Ohm 1/10 Watt 1% Resistor 680 Ohm 1/10 Watt 1% Resistor 750 Ohm 1/10 Watt 1% Resistor 1.0K Ohm 1/10 Watt 1% Resistor 1.5K Ohm 1/10 Watt 1% Resistor 2.0K Ohm 1/10 Watt 1% Resistor 2.2K Ohm 1/10 Watt 1% Resistor 3.3K Ohm 1/10 Watt 1% Resistor 4.7K Ohm 1/10 Watt 1% Resistor 10.0K Ohm 1/10 Watt 1% Resistor 12.0K Ohm 1/10 Watt 1% Resistor 12.1K Ohm 1/10 Watt 1% Resistor 20.0K Ohm 1/10 Watt 1% Resistor 33.0K Ohm 1/10 Watt 1% Resistor 100.0K Ohm 1/10 Watt 1% Resistor 0805 - 0805 Surface Mount Package 0 Ohm 1/8 Watt 1% Resistor 33 Ohm 1/8 Watt 1% Resistor 100 Ohm 1/8 Watt 1% Resistor 150 Ohm 1/8 Watt 1% Resistor 200 Ohm 1/8 Watt 1% Resistor 240 Ohm 1/8 Watt 1% Resistor 330 Ohm 1/8 Watt 1% Resistor 390 Ohm 1/8 Watt 1% Resistor 470 Ohm 1/8 Watt 1% Resistor 1.0K Ohm 1/8 Watt 1% Resistor 1.5K Ohm 1/8 Watt 1% Resistor 2.0K Ohm 1/8 Watt 1% Resistor 4.7K Ohm 1/8 Watt 1% Resistor 5.1K Ohm 1/8 Watt 1% Resistor 5.6K Ohm 1/8 Watt 1% Resistor 10.0K Ohm 1/8 Watt 1% Resistor 22.0K Ohm 1/8 Watt 1% Resistor 33.0K Ohm 1/8 Watt 1% Resistor 100K Ohm 1/8 Watt 1% Resistor 1206 - 1206 Surface Mount Package 2012 - 2010 Surface Mount Package 0.11 Ohm 1/2 Watt 1% Resistor - Digikey: RHM.11UCT-ND
R12 = 3386P-1-104LF:3386P-1-104LF; COPYRIGHT: Copyright (C) 2024 Ultra Librarian. All rights reserved.; MANUFACTURER_PART_NUMBER: 3386P-1-104LF; MFR_NAME: Bourns Electronics
S1 = SamacSys_Parts:GPTS203211B: Pushbutton Switches SPST ON-OFF Source: Datasheet <http://switches-connectors-custom.cwind.com/Asset/GPTS203211BR2.pdf>; DESCRIPTION: Pushbutton Switches SPST ON-OFF; HEIGHT: mm; MANUFACTURER_NAME: CW Industries; MANUFACTURER_PART_NUMBER: GPTS203211B; MOUSER_PART_NUMBER: 629-GPTS203211B; MOUSER_PRICE-STOCK: https://www.mouser.co.uk/ProductDetail/CW-Industries/GPTS203211B?qs=sajaCoHCXPR%252BmLwibobs6Q%3D%3D
U1 = microbuilder:MAX4466: MAX4466 - Microphone Pre-Amp
U8 = BNO055:BNO055: BNO055 9-axis Absolute Orientation Sensor ( SiP ) w/Sensors and Sensor Fusion Buy Part <https://snapeda.com/parts/BNO055/Bosch/view-part/?ref=eda>; AVAILABILITY: Warning; DESCRIPTION: Accelerometer, Gyroscope, Magnetometer, 9 Axis Sensor I²C, UART Output; DIGIKEY-PURCHASE-URL: https://snapeda.com/shop?store=DigiKey&id=51961; MF: Bosch; MOUSER-PURCHASE-URL: https://snapeda.com/shop?store=Mouser&id=51961; MP: BNO055; PACKAGE: LGA-28 Bosch; PRICE: None
U$1 = Teensy_Audioshield:AUDIOSHIELD: Teensy 3 Audioshield by PJRC.COM
U$7 = pinhead:PINHD-1X10: PIN HEADER
U$11 U$14-U$19 = microbuilder:MOUNTINGHOLE: Mounting Hole For #2 screws (0.086"/2.18mm width, 0.094"/2.4mm hole) use 2.5mm; BOM: EXCLUDE
VR1 = SamacSys_Parts:3310P-125-103L: POT 10K OHM 1/4W PLASTIC LINEAR Source: Datasheet <https://www.bourns.com/docs/Product-Datasheets/3310.pdf>; ARROW_PART_NUMBER: 3310P-125-103L; ARROW_PRICE-STOCK: https://www.arrow.com/en/products/3310p-125-103l/bourns?region=nac; DESCRIPTION: POT 10K OHM 1/4W PLASTIC LINEAR; HEIGHT: 18.9mm; MANUFACTURER_NAME: Bourns; MANUFACTURER_PART_NUMBER: 3310P-125-103L; MOUSER_PART_NUMBER: 652-3310P-125-103L; MOUSER_PRICE-STOCK: https://www.mouser.co.uk/ProductDetail/Bourns/3310P-125-103L?qs=%2FALxmKEvhOKZldKKUAf6OQ%3D%3D
Y1 = NDK - NX3215SA-32.768K-STD-MUA-8:NDK_NX3215SA-32.768K-STD-MUA-8: Crystal Unit; CENTROID_NOT_SPECIFIED: No; DATASHEET: http://www.ndk.com/images/products/catalog/c_NX3215SA-STD-MUA-14_e.pdf; DIGIKEY_DESCRIPTION: CRYSTAL 32.7680KHZ 12.5PF SMD; DIGIKEY_PART_NUMBER: 644-1156-1-ND; FREQUENCY: 32.768kHz; LEAD_FREE: yes; MF: NDK; MPN: NX3215SA-32.768K-STD-MUA-8; PACKAGE: XTAL_3MM2_1MM5; PREFIX: Y; ROHS: yes; TEMPERATURE_RANGE_HIGH: +85°C; TEMPERATURE_RANGE_LOW: -40°C

## Net classes
0 default: width 0.203 mm
2 ICPower: width 0.203 mm